# EAGLE design 180V_StepUp555 (EAGLE 9.6.1)
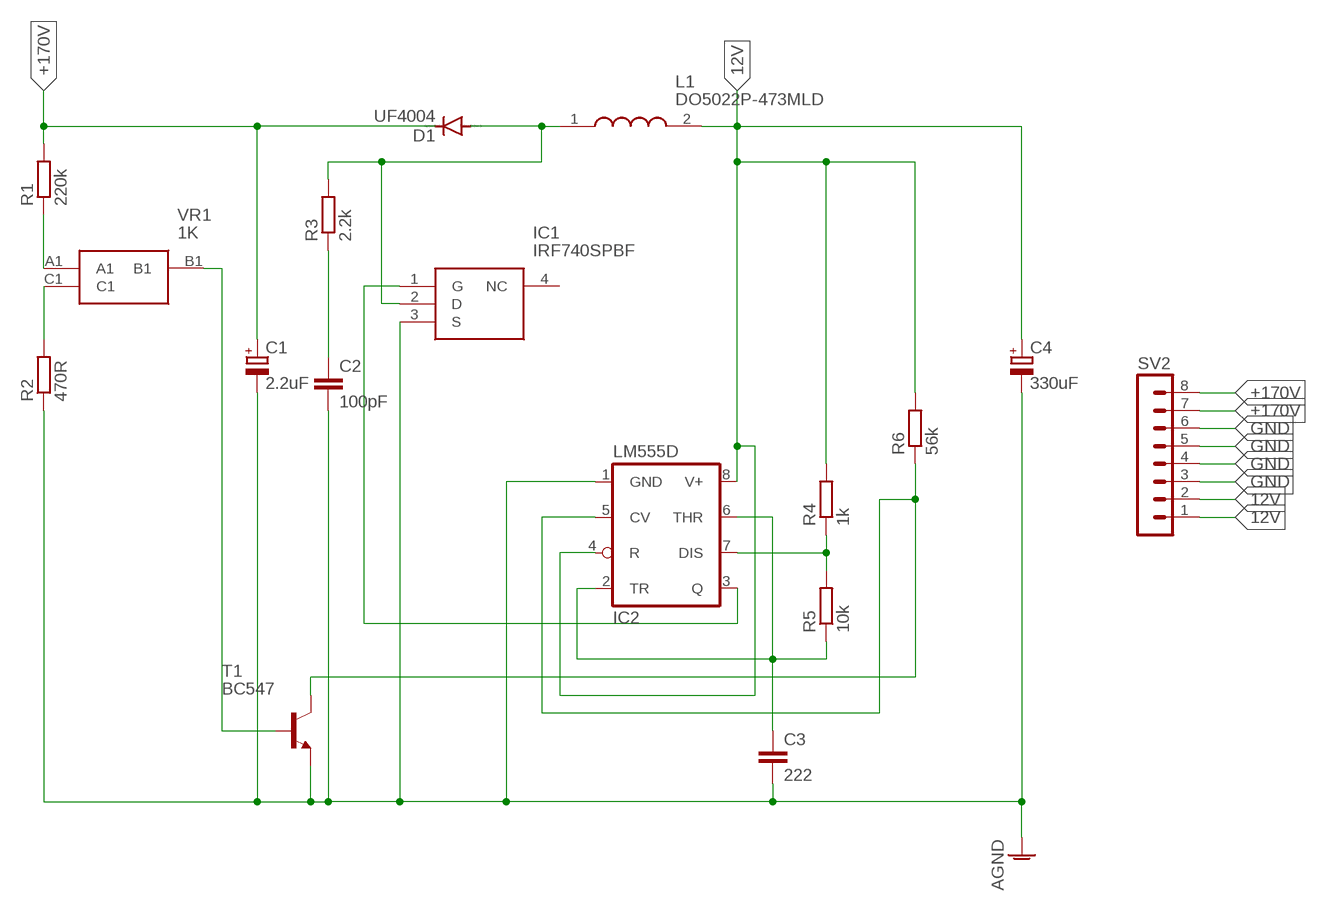
[diagram p0: schematic, sheet 1]

## Parts
C1  2.2uF  CPOL-EUE2.5-6  [E2,5-6]
C2  100pF  C-EU050-024X044  [C050-024X044]
C3  222  C-EU050-024X044  [C050-024X044]
C4  330uF  CPOL-EUE2.5-6  [E2,5-6]
D1  UF4004  DIODE-DO41-7.6  [DO41-7.6]
IC1  IRF740SPBF  [TO254P1524X483-4N]
IC2  LM555D  [SO08]
L1  DO5022P-473MLD  [DO5022P473MLD]
R1  220k  CARBON/METAL_FILM_RESISTOR0207/10  [0207/10]
R2  470R  CARBON/METAL_FILM_RESISTOR0207/10  [0207/10]
R3  2.2k  CARBON/METAL_FILM_RESISTOR0207/10  [0207/10]
R4  1k  CARBON/METAL_FILM_RESISTOR0207/10  [0207/10]
R5  10k  CARBON/METAL_FILM_RESISTOR0207/10  [0207/10]
R6  56k  CARBON/METAL_FILM_RESISTOR0207/10  [0207/10]
SV2  MA08-1  [MA08-1]
T1  BC547  [TO92]
VR1  1K  EVM3YSX50B14  [EVM3YSX50B14]

## Nets
12V: C4.+ IC2.4(R) IC2.8(V+) L1.2 R4.2 R6.2 SV2.1 SV2.2
+170V: C1.+ D1.C R1.2 SV2.7 SV2.8
GND: C1.- C2.2 C3.2 C4.- IC1.3(S) IC2.1(GND) R2.1 SV2.3 SV2.4 SV2.5 SV2.6 T1.1(E) ; supply symbol labelled AGND
N$1: R2.2 VR1.C1
N$2: R1.1 VR1.A1
N$4: T1.2(B) VR1.B1
N$5: D1.A IC1.2(D) L1.1 R3.2
N$7: IC2.5(CV) R6.1 T1.3(C)
N$8: C2.1 R3.1
N$9: C3.1 IC2.2(TR) IC2.6(THR) R5.1
N$10: IC2.7(DIS) R4.1 R5.2
N$12: IC1.1(G) IC2.3(Q)
Unconnected: IC1.4(NC)

## Library data of the parts
C1 C4 = rcl:CPOL-EU: POLARIZED CAPACITOR, European symbol; SPICEPREFIX: C
C2 C3 = rcl:C-EU: CAPACITOR, European symbol; SPICEPREFIX: C
D1 = diode:DIODE-: DIODE
IC1 = CommonParts:IRF740SPBF: MOSFET N-Channel 400V 10A D2PAK Vishay IRF740SPBF N-channel MOSFET Transistor, 10 A, 400 V, 3-Pin D2PAK, TO-263AB Source: Datasheet <https://componentsearchengine.com/Datasheets/1/IRF740SPBF.pdf>; DESCRIPTION: MOSFET N-Channel 400V 10A D2PAK Vishay IRF740SPBF N-channel MOSFET Transistor, 10 A, 400 V, 3-Pin D2PAK, TO-263AB; HEIGHT: 4.83mm; MANUFACTURER_NAME: Vishay; MANUFACTURER_PART_NUMBER: IRF740SPBF; MOUSER2_PART_NUMBER: 844-IRF740SPBF; MOUSER2_PRICE-STOCK: https://www.mouser.com/Search/Refine.aspx?Keyword=844-IRF740SPBF
IC2 = linear:*555: TIMER
L1 = DO5022P-473MLD:DO5022P-473MLD: Fixed Inductors Source: Datasheet <https://componentsearchengine.com/Datasheets/2/DO5022P-473MLD.pdf>; DESCRIPTION: Fixed Inductors; HEIGHT: 7.11mm; MANUFACTURER_NAME: COILCRAFT; MANUFACTURER_PART_NUMBER: DO5022P-473MLD; MOUSER_PART_NUMBER: 994-DO5022P-473MLD; MOUSER_PRICE-STOCK: https://www.mouser.co.uk/ProductDetail/Coilcraft/DO5022P-473MLD?qs=zCSbvcPd3pbc7sRa9lUHxw%3D%3D
R1-R6 = CommonParts:CARBON/METAL_FILM_RESISTOR: RESISTOR, European symbol; SPICEPREFIX: R
SV2 = con-lstb:MA08-1: PIN HEADER; OC_FARNELL: unknown; OC_NEWARK: unknown
T1 = transistor:BC547: NPN TRANSISTOR
VR1 = CommonParts:EVM3YSX50B14: SMD Cermet Trimmer Pot, 3mm Sq, 10K Source: Datasheet; DESCRIPTION: SMD Cermet Trimmer Pot, 3mm Sq, 10K; HEIGHT: 1.55mm; MANUFACTURER_NAME: Panasonic; MANUFACTURER_PART_NUMBER: EVM3YSX50B14

## Board
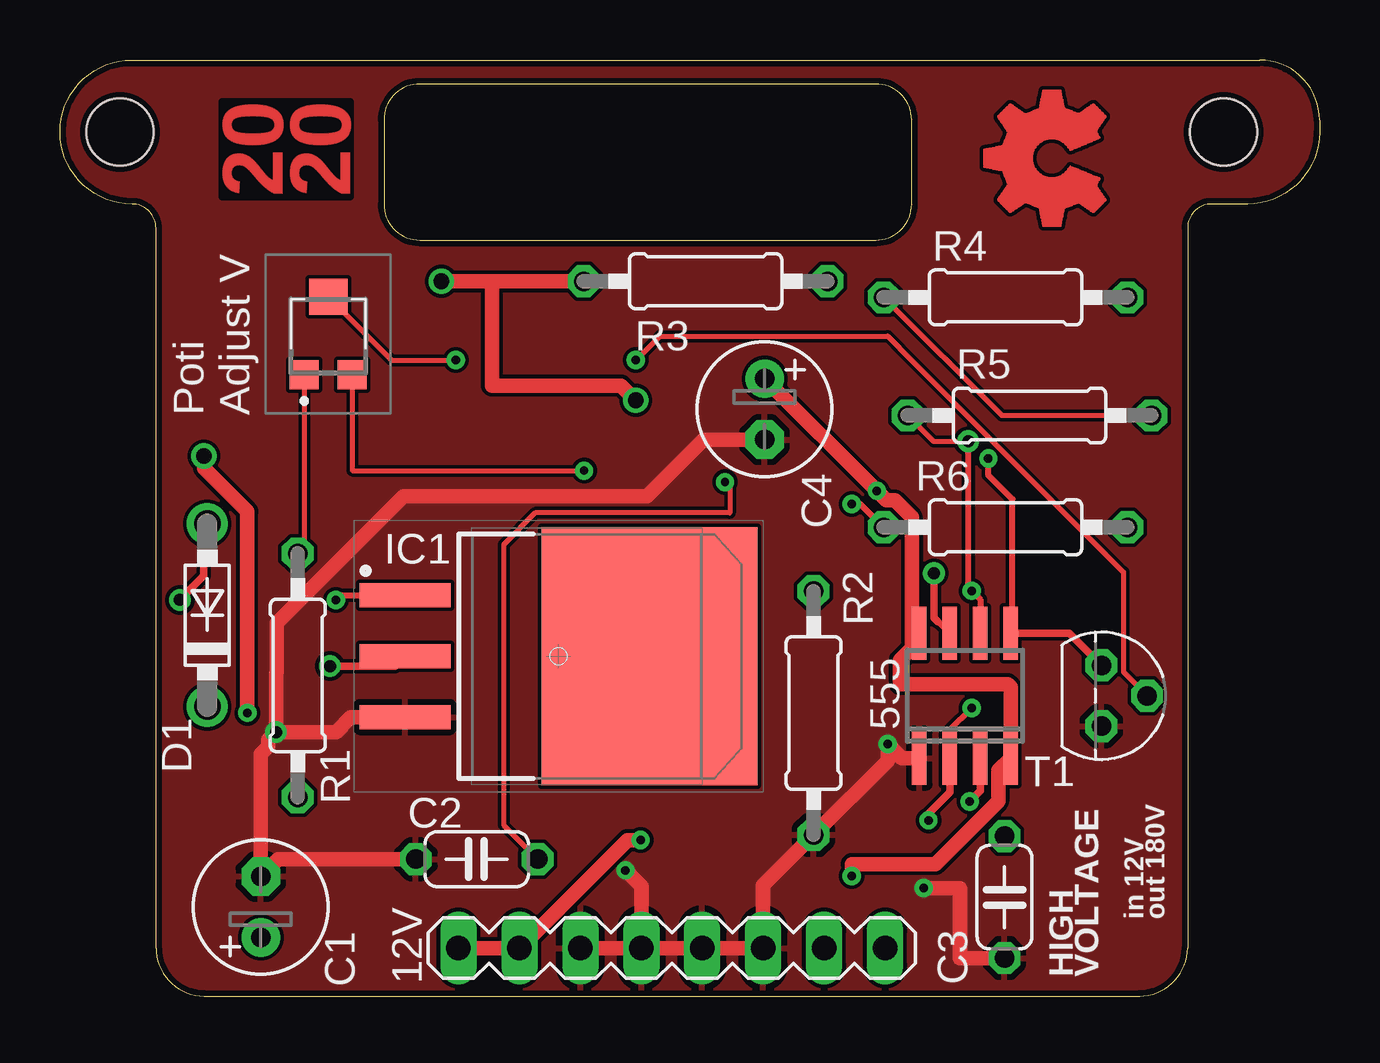
[diagram p1: board, top side]
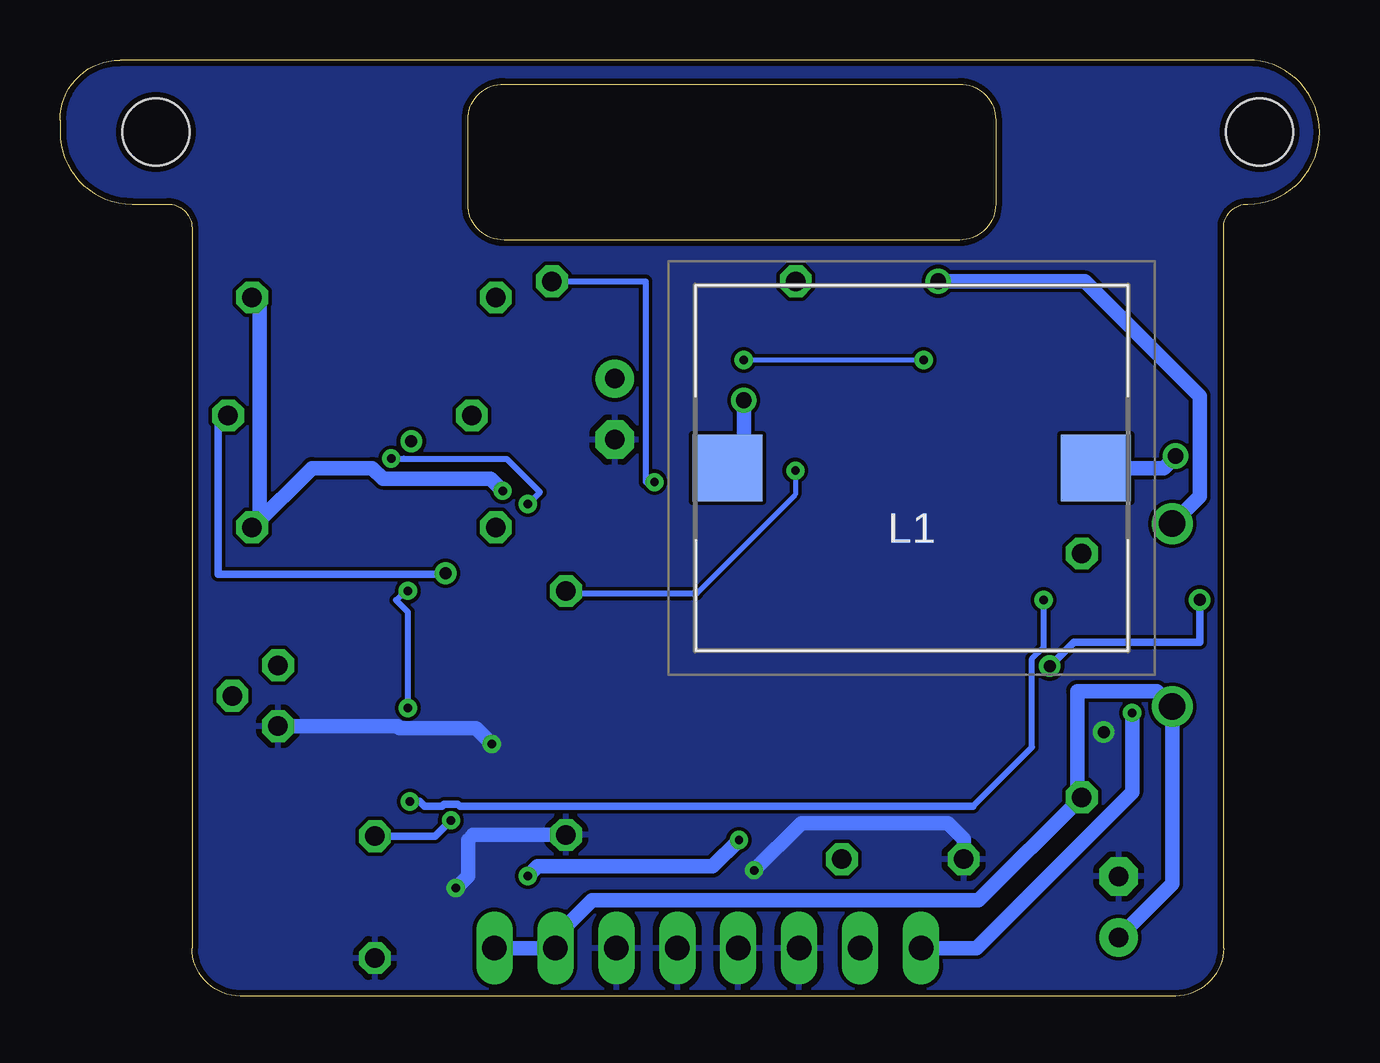
[diagram p2: board, bottom side, seen from below]

Size 52.5 x 39 mm. Coordinates in mm from the lower left corner, seen from the top.
Outline: 4,2 4,32 arc90 3,33 arc-90 0,36 arc-90 3,39 50,39 arc-90 52.5,36.5 52.5,36 arc-90 49.5,33 48,33 arc90 47,32 47,2 arc-90 45,0 6,0 arc-90 4,2
Outline: 35.5,33 35.5,36.5 arc90 34,38 15,38 arc90 13.5,36.5 13.5,33 arc90 15,31.5 34,31.5 arc90 35.5,33
Copper layers (1*16): Top 0.035mm / dielectric 1.5mm / Bottom 0.035mm
Design rules "default *": minimum track width 6mil, minimum drill 0.35mm, track to track 6mil, track to pad 6mil, pad to pad 6mil, via to via 6mil, smd to smd 6mil, copper to edge 10mil, drill to drill 6mil, minimum pad ring 10mil, minimum via ring 8mil, stop-mask expansion 4mil, vias tented up to drill 0mil, thermal gap 10mil
Holes 2.8 mm at 48.5,36 2.5,36

### Footprints (pad centres in the part's own frame; a part is rotated, then mirrored left to right if it is on the bottom)
E2,5-6 = drill 0.813 pad 1.6: + -1.27,0 | drill 0.813 pad 1.6 octagon: - 1.27,0
C050-024X044 = drill 0.813 octagon: 1 -2.54,0; 2 2.54,0
DO41-7.6 = drill 1.1 pad 1.7: A 3.81,0; C -3.81,0
TO254P1524X483-4N = smd 3.8 x 1: 1 -6.4,2.54; 2 -6.4,0; 3 -6.4,-2.54 | smd 9 x 10.75: 4 3.8,0
SO08 = smd 0.6 x 2.2: 1 -1.905,-2.6; 2 -0.635,-2.6; 3 0.635,-2.6; 4 1.905,-2.6; 5 1.905,2.6; 6 0.635,2.6; 7 -0.635,2.6; 8 -1.905,2.6
DO5022P473MLD = smd 2.92 x 2.79: 1 -7.685,0; 2 7.685,0
0207/10 = drill 0.813 octagon: 1 -5.08,0; 2 5.08,0
MA08-1 = drill 1.016 long: 1 -8.89,0; 2 -6.35,0; 3 -3.81,0; 4 -1.27,0; 5 1.27,0; 6 3.81,0; 7 6.35,0; 8 8.89,0
TO92 = drill 0.813 octagon: 1 1.27,0; 2 0,1.905; 3 -1.27,0
EVM3YSX50B14 = smd 1.2 x 1.2: A1 -1,-1.6; C1 1,-1.6 | smd 1.6 x 1.5: B1 0,1.65

### Placement (x,y rotation side)
C1  8.37,3.71 90 top
C2  17.37,5.7 180 top
C3  39.37,4.12 270 top
C4  29.37,24.45 270 top
D1  6.14,15.87 90 top
IC1  20.78,14.16 0 top
IC2  37.72,12.51 0 top
L1  17,22 0 bottom
R1  9.91,13.36 270 top
R2  31.41,11.79 90 top
R3  26.91,29.78 180 top
R4  39.41,29.11 0 top
R5  40.41,24.19 0 top
R6  39.41,19.53 0 top
SV2  25.5,2 0 top
T1  43.41,12.51 270 top
VR1  11.18,27.49 0 top

### Tracks (layer width: path | path; a pad name or v marks a point on that pad's centre or on a via)
12V  (via drill 0.35, 0.65)
  Top 0.61: SV2.1 SV2.2 23.65,6.5 v24.2,6.5 | v33,5 33,5.5 36.49,5.5 39.11,8.12 39.11,9.4 IC2.4 39.62,12.88 39.5,13 35,13 35,14 35.5,14.5 | 35.5,14.5 35.5,19.94 34.79,20.65 34.44,20.65 v34.05,21.05 C4.+ | 35.5,14.5 35.81,14.81 IC2.8 | v7.81,11.8 7.81,20.19 6,22 v6,22.5
  Bottom 0.61: R4.2 44.39,29.11 44.17,28.89 44.17,19.85 R6.2 44.47,19.53 42,22 39.48,22 39.04,21.56 34.56,21.56 v34.05,21.05 34,21 | v33,5 32.6,5.4 25.3,5.4 v24.2,6.5 | v7.81,11.8 7.81,8.49 14.3,2 SV2.1 | L1.2 6.5,22 v6,22.5
+170V
  Bottom 0.61: SV2.7 SV2.8 32.3,2 30.31,3.98 14.21,3.98 R1.2 | R1.2 | C1.+ 6.14,4.67 D1.C 6.78,12.7 10.1,12.7 10.1,8.47 R1.2
GND  (via drill 0.35, 0.5)
  Top 0.61: SV2.3 SV2.4 | SV2.4 SV2.5 SV2.6 29.31,4.61 R2.1 34.5,9.8 v34.5,10.5 35.09,9.91 IC2.1 | v9,11 9,13.45 9.03,13.48 9.03,15.53 14.33,20.83 24.47,20.83 26.82,23.18 C4.- | C3.2 37.5,1.58 37.5,4.5 v36,4.5 | v23.57,5.23 24.23,4.57 SV2.4 | C2.2 9.09,5.7 C1.- 8.37,10.08 8.67,10.38 8.67,10.67 v9,11 | v9,11 11.5,11 12.12,11.62 12.5,11.62 13.66,11.62 IC1.3
  Bottom 0.61: v36,4.5 35.5,5 35.5,6.5 35.29,6.71 R2.1 | T1.1 38.42,11.24 38.35,11.16 35.16,11.16 v34.5,10.5 | C2.2 14.83,6.53 15.5,7.2 21.6,7.2 v23.57,5.23
  pour Top: 0,39 0,0 52.5,0 52.5,39
  pour Bottom: 0,39 52.5,39 52.5,0 0,0
N$1  (via drill 0.35)
  Top 0.203: VR1.C1 12.18,21.89 v21.84,21.89
  Bottom 0.203: v21.84,21.89 21.84,20.89 25.96,16.77
  Bottom 0.254: 25.96,16.77 31.31,16.77 R2.2
N$2
  Top 0.203: VR1.A1 10.18,18.44 R1.1
N$4  (via drill 0.35)
  Top 0.203: VR1.B1 13.82,26.5 v16.5,26.5 | T1.2 44.32,13.5 44.32,17.66 34.99,26.99 | 34.88,27.1 34.99,26.99 | v24,26.5 25,27.5 34.5,27.5 34.99,27.01 34.99,26.99
  Bottom 0.203: v16.5,26.5 v24,26.5
N$5  (via drill 0.5, 0.65)
  Top 0.305: v5,16.5 6,17.5 6,19.54 D1.A | v11.25,13.75 13.97,13.75 IC1.2
  Top 0.61: v15.9,29.78 18,29.78 | 18,29.78 R3.2 | v24,24.82 23.39,25.43 18,25.43 18,29.78
  Bottom 0.305: v11.25,13.75 10.25,14.75 5,14.75 v5,16.5 | D1.A 6.14,20.02
  Bottom 0.61: D1.A 5,20.82 5,25 9.78,29.78 v15.9,29.78 | L1.1 24,22.68 v24,24.82
N$7  (via drill 0.35)
  Top 0.254: IC2.5 39.7,15.19 39.7,20.7 38.7,21.7 v38.7,22.39 | v33,20.5 33.36,20.5 R6.1
  Top 0.305: IC2.5 42.08,15.11 T1.3
  Bottom 0.254: v38.7,22.39 38.18,22.39 38.16,22.38 33.88,22.38 32.5,21 v33,20.5
N$8  (via drill 0.35)
  Top 0.203: C2.1 18.49,7.12 18.49,18.8 19.81,20.13 27.92,20.13 27.92,21.2 v27.72,21.41
  Bottom 0.254: R3.1 28.09,29.78 28.09,21.41 v27.72,21.41
N$9  (via drill 0.35, 0.5)
  Top 0.203: R5.1 36.41,23.11 v37.85,23.11
  Top 0.254: IC2.2 37.09,11.09 v38,12 | IC2.6 38.35,16.53 v38,16.88 37.85,17.03 v37.85,23.11
  Top 0.305: IC2.2 37.09,8.48 36.1,7.5 36.1,7.42 v36.2,7.32
  Bottom 0.254: v38,12 38,16 38.5,16.5 38.12,16.88 v38,16.88
  Bottom 0.305: 38,23.25 v37.85,23.11 | v36.2,7.32 36.86,6.66 C3.1
N$10  (via drill 0.5)
  Top 0.203: R4.1 39.25,24.19 R5.2
  Top 0.254: 36.6,15.6 IC2.7
  Top 0.305: v36.43,17.61 36.43,15.76 36.6,15.6
  Bottom 0.305: v36.43,17.61 36.48,17.57 45.9,17.57 45.9,24.19 R5.2
N$12  (via drill 0.35)
  Top 0.254: v11.5,16.5 11.7,16.7 IC1.1
  Top 0.305: v37.92,8.11 38.35,8.54 IC2.3
  Bottom 0.254: v11.5,16.5 11.5,14.54 11.98,14.05 11.98,10.37 14.45,7.9
  Bottom 0.305: v37.92,8.11 37.51,8.11 37.3,7.9 36.58,7.9 36.48,8 35.92,8 35.82,7.9 14.45,7.9
(copper drawn outside any net)
  shapes: Top area x369

### Text on the board
Top: 20 / 20
tNames: Poti / Adjust V | IC1 | 555 | T1 | D1 | R1 | C2 | in 12V / out 180V | HIGH / VOLTAGE | C1 | 12V
tStop: 20 / 20